# Altium project xDAC-v3.PrjPcb (part 7 of 7)
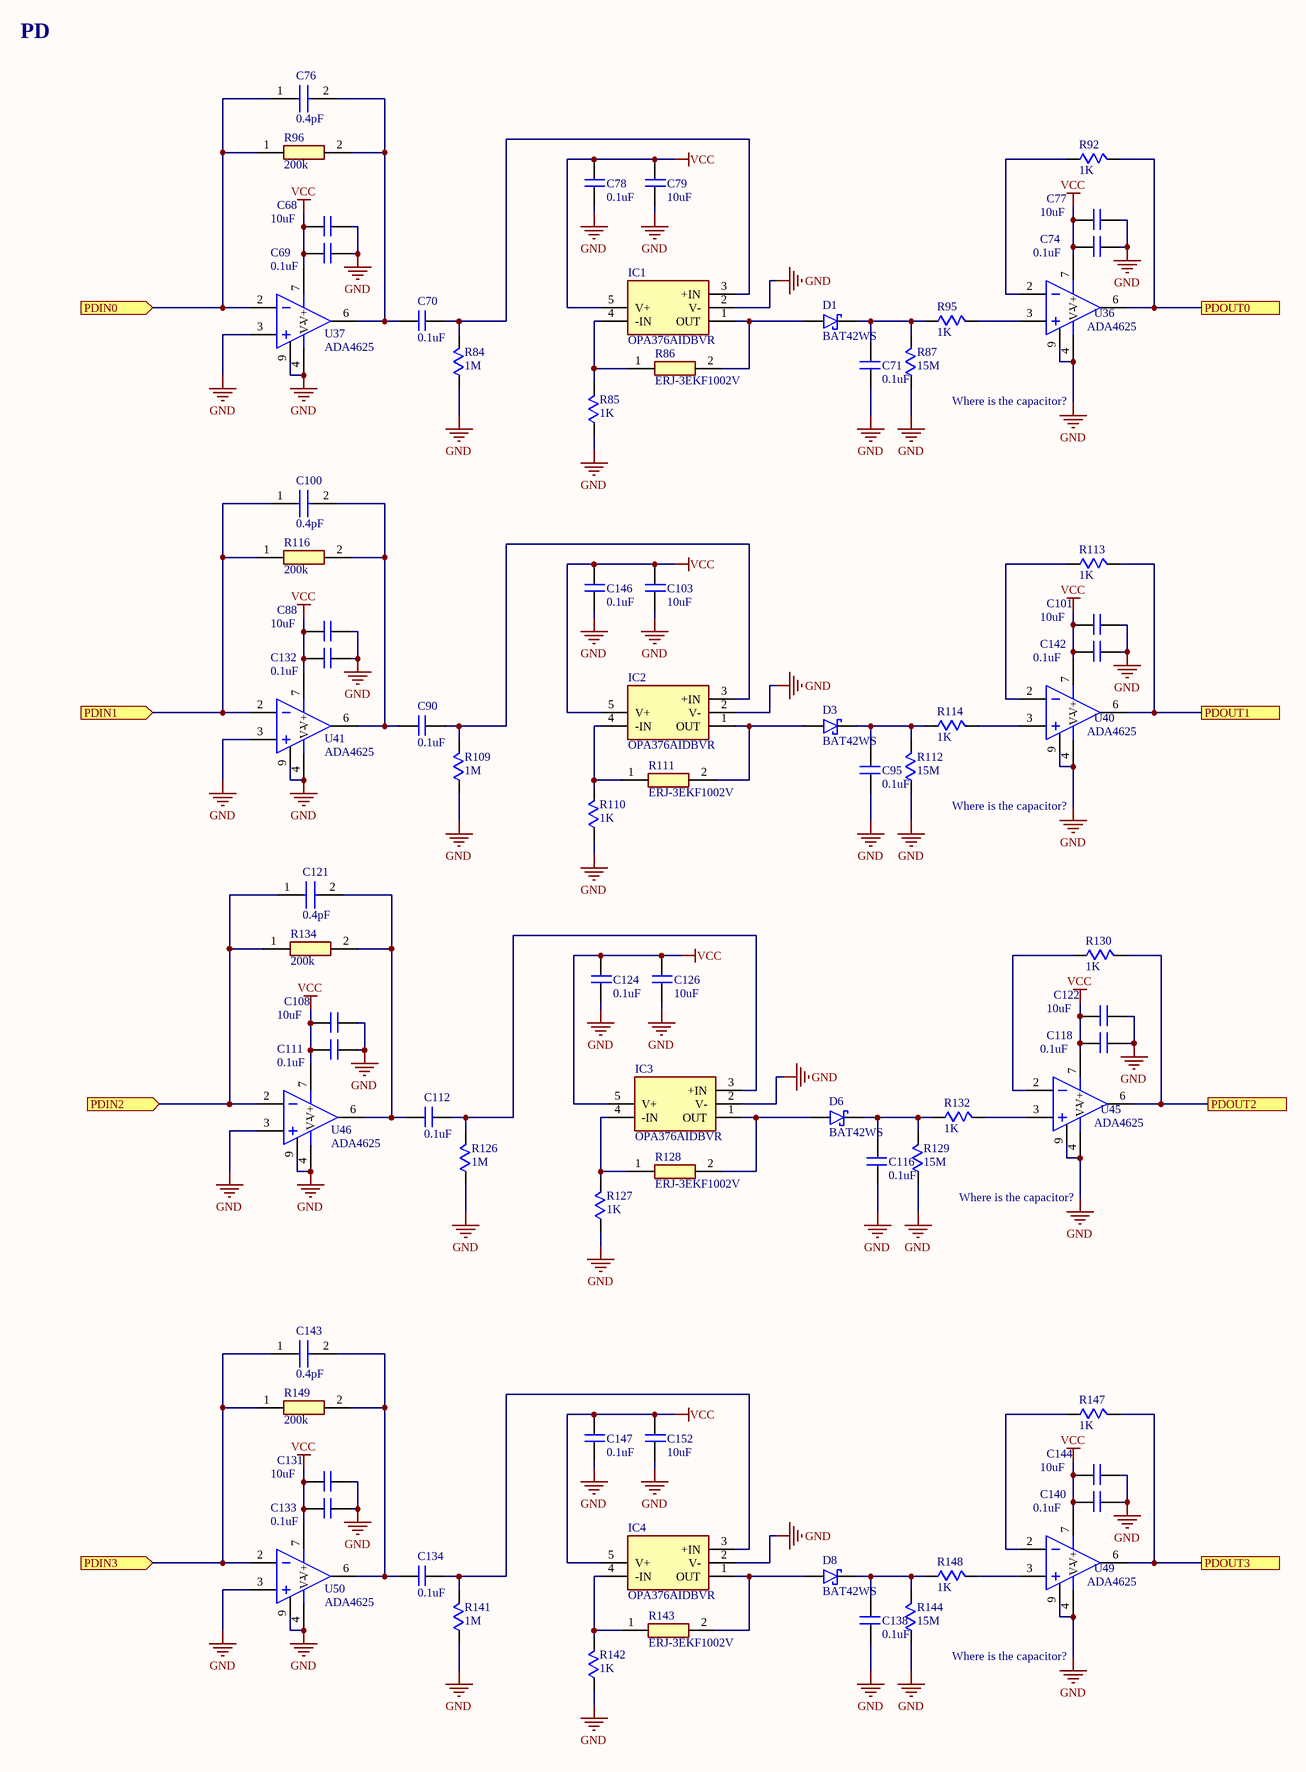
[diagram p23: PD.SchDoc]

## Nets that join several sheets
3V3: Fan & Power Out (Q8.2), iDAC1 (10 pins), iDAC2 (10 pins), Power (9 pins), TEC_CONTROLLER_1 (16 pins)
+8V: LIM+LEDS+POWER (U34.4), Power (8 pins)
+12V: Fan & Power Out (6 pins), PI_INTERFACE (J47.3 J47.5 J47.6), Power (38 pins)
-12V: Fan & Power Out (R121.1), Power (5 pins)
C1_V+: Power (C13.1 L6.2), vDAC1 (J20.25 J20.27), vDAC2 (J53.25 J53.27)
C1_V-: LIM+LEDS+POWER (U34.11), Power (C10.1 C47.2 L3.2 R53.2), vDAC1 (J20.43 J20.45), vDAC2 (J53.43 J53.45)
C2_V+: Power (C12.1 L5.2), vDAC1 (J20.26 J20.28), vDAC2 (J53.26 J53.28)
C2_V-: Fan & Power Out (R122.1), Power (C9.1 C73.2 L2.2 R93.2), vDAC1 (J20.44 J20.46), vDAC2 (J53.44 J53.46)
C3_V+: Power (C11.1 L4.2), vDAC1 (J20.83 J20.85), vDAC2 (J53.83 J53.85)
C3_V-: Power (C8.1 C67.2 L1.2 R88.2), vDAC1 (J20.91 J20.93), vDAC2 (J53.91 J53.93)
EDFA_POWER: PIO (J6.01 J6.02), Power (5 pins)
GND: ChipSelects+Faults (25 pins), Fan & Power Out (17 pins), iDAC1 (44 pins), iDAC2 (34 pins), LIM+LEDS+POWER (14 pins), PI_INTERFACE (26 pins), PIO (44 pins), Power (103 pins), RX_FlexiConnectors (62 pins), TEC_CONTROLLER_1 (22 pins), TEC_CONTROLLER_2 (12 pins), TEC_CONTROLLER_3 (12 pins), TX_FlexiConnectors (71 pins), vDAC1 (26 pins), vDAC2 (26 pins), ADC-DAC (55 pins), PIC closed loop (29 pins), PD (64 pins)
VCC: ChipSelects+Faults (29 pins), Fan & Power Out (20 pins), iDAC1 (24 pins), iDAC2 (24 pins), LIM+LEDS+POWER (10 pins), PI_INTERFACE (13 pins), PIO (30 pins), Power (7 pins), TEC_CONTROLLER_1 (5 pins), TEC_CONTROLLER_2 (5 pins), TEC_CONTROLLER_3 (5 pins), vDAC1 (18 pins), vDAC2 (10 pins), ADC-DAC (21 pins), PIC closed loop (32 pins), PD (36 pins)
VCC-TEC: Power (7 pins), TEC_CONTROLLER_1 (9 pins), TEC_CONTROLLER_2 (9 pins), TEC_CONTROLLER_3 (9 pins)
+5V-STANDBY: PI_INTERFACE (J1.3), Power (J22.9)
A_CLK: iDAC1 (J30.01), iDAC2 (J45.01), PI_INTERFACE (U64.4), vDAC1 (J20.01 R210.1), vDAC2 (J53.01)
A_SDI: iDAC1 (J30.03), iDAC2 (J45.03), PI_INTERFACE (U64.12), vDAC1 (J20.03 R208.1), vDAC2 (J53.03)
A_SDO: iDAC1 (J30.05), iDAC2 (J45.05), PI_INTERFACE (U64.9), vDAC1 (J20.05 R205.1), vDAC2 (J53.05)
B_CLK: iDAC1 (J30.02), iDAC2 (J45.02), PI_INTERFACE (U64.2), vDAC1 (J20.02 R211.1), vDAC2 (J53.02)
B_SDI: iDAC1 (J30.04), iDAC2 (J45.04), PI_INTERFACE (U64.10), vDAC1 (J20.04 R209.1), vDAC2 (J53.04)
B_SDO: iDAC1 (J30.06), iDAC2 (J45.06), PI_INTERFACE (U64.5), vDAC1 (J20.06 R206.1), vDAC2 (J53.06)
C_CLK: ChipSelects+Faults (5 pins), LIM+LEDS+POWER (R58.2), PI_INTERFACE (R2.1 R6.2 U64.1 U64.3), PIO (U1.8 U2.8 U27.8 U55.8)
C_SDI: ChipSelects+Faults (U25.9), LIM+LEDS+POWER (R61.2), PI_INTERFACE (5 pins), PIO (U1.9 U2.9 U27.9 U55.9)
C_SDO: LIM+LEDS+POWER (R60.1), PI_INTERFACE (R3.1 R4.2 U64.6 U64.8), PIO (U1.10 U2.10 U27.10 U55.10)
CS_PIO: ChipSelects+Faults (U65.13), PIO (U1.7)
CS_PIO2: ChipSelects+Faults (U65.11), PIO (U55.7)
CS_PIO3: ChipSelects+Faults (U65.10), PIO (U2.7)
CS_PIO4: PI_INTERFACE (R102.1 R103.2), PIO (U27.7)
EDFA1_PowerA: Fan & Power Out (J57.1 Q10.6), PIO (J14.1 J14.2 J14.29 J14.30)
EDFA3_PowerB: Fan & Power Out (J56.1 Q10.4), PIO (J12.1 J12.2 J12.29 J12.30)
EnEDFA1_PowerOut: Fan & Power Out (R195.1), PIO (U69.12)
FANALERT: ChipSelects+Faults (U25.7), Fan & Power Out (R29.1 U5.14)
FANFAIL: ChipSelects+Faults (U25.4), Fan & Power Out (R20.1 U5.5)
FANTHROTTLE: ChipSelects+Faults (U25.5), Fan & Power Out (R19.1 U5.6)
FP_LED: Fan & Power Out (J43.1), PI_INTERFACE (J2.15)
GPB4#: Fan & Power Out (R119.1), PIO (U69.8)
GPB5#: Fan & Power Out (R198.1), PIO (U69.10)
GPIO25: Fan & Power Out (Q14.3 R250.2), PI_INTERFACE (J2.22)
iDAC1_C1_CS: ChipSelects+Faults (U35.9), iDAC1 (J30.09)
iDAC1_C1_FAULT: ChipSelects+Faults (U39.6), iDAC1 (J30.23)
iDAC1_C1_OUT1: iDAC1 (J30.11), TX_FlexiConnectors (J10.60)
iDAC1_C1_OUT2: iDAC1 (J30.13), TX_FlexiConnectors (J10.58)
iDAC1_C1_OUT3: iDAC1 (J30.15), TX_FlexiConnectors (J10.57)
iDAC1_C1_OUT4: iDAC1 (J30.17), TX_FlexiConnectors (J10.55)
iDAC1_C1_OUT5: iDAC1 (J30.19), TX_FlexiConnectors (J10.54)
iDAC1_C2_CS: ChipSelects+Faults (U35.7), iDAC1 (J30.31)
iDAC1_C2_FAULT: ChipSelects+Faults (U39.7), iDAC1 (J30.45)
iDAC1_C2_OUT1: iDAC1 (J30.33), TX_FlexiConnectors (J10.53)
iDAC1_C2_OUT2: iDAC1 (J30.35), TX_FlexiConnectors (J10.52)
iDAC1_C2_OUT3: iDAC1 (J30.37), TX_FlexiConnectors (J10.51)
iDAC1_C2_OUT4: iDAC1 (J30.39), TX_FlexiConnectors (J10.50)
iDAC1_C2_OUT5: iDAC1 (J30.41), TX_FlexiConnectors (J15.27)
iDAC1_C3_CS: ChipSelects+Faults (U43.15), iDAC1 (J30.53)
iDAC1_C3_FAULT: ChipSelects+Faults (U47.15), iDAC1 (J30.67)
iDAC1_C3_OUT1: iDAC1 (J30.55), TX_FlexiConnectors (J15.25)
iDAC1_C3_OUT2: iDAC1 (J30.57), TX_FlexiConnectors (J15.23)
iDAC1_C3_OUT3: iDAC1 (J30.59), TX_FlexiConnectors (J15.21)
iDAC1_C3_OUT4: iDAC1 (J30.61), TX_FlexiConnectors (J15.19)
iDAC1_C3_OUT5: iDAC1 (J30.63), TX_FlexiConnectors (J15.17)
iDAC1_C4_CS: ChipSelects+Faults (U43.14), iDAC1 (J30.75)
iDAC1_C4_FAULT: ChipSelects+Faults (U47.1), iDAC1 (J30.89)
iDAC1_C4_OUT1: iDAC1 (J30.77), TX_FlexiConnectors (J15.15)
iDAC1_C4_OUT2: iDAC1 (J30.79), TX_FlexiConnectors (J15.13)
iDAC1_C4_OUT3: iDAC1 (J30.81), TX_FlexiConnectors (J15.11)
iDAC1_C4_OUT4: iDAC1 (J30.83), TX_FlexiConnectors (J15.9)
iDAC1_C4_OUT5: iDAC1 (J30.85), TX_FlexiConnectors (J15.7)
iDAC1_C5_CS: ChipSelects+Faults (U43.13), iDAC1 (J30.97)
iDAC1_C5_FAULT: ChipSelects+Faults (U47.2), iDAC1 (J30.111)
iDAC1_C5_OUT1: iDAC1 (J30.99), TX_FlexiConnectors (J15.5)
iDAC1_C5_OUT2: iDAC1 (J30.101), TX_FlexiConnectors (J10.3)
iDAC1_C5_OUT3: iDAC1 (J30.103), TX_FlexiConnectors (J10.5)
iDAC1_C5_OUT4: iDAC1 (J30.105), TX_FlexiConnectors (J10.6)
iDAC1_C5_OUT5: iDAC1 (J30.107), TX_FlexiConnectors (J10.8)
iDAC1_C6_CS: ChipSelects+Faults (U43.12), iDAC1 (J30.10)
iDAC1_C6_FAULT: ChipSelects+Faults (U47.3), iDAC1 (J30.24)
iDAC1_C6_OUT1: iDAC1 (J30.12), TX_FlexiConnectors (J10.9)
iDAC1_C6_OUT2: iDAC1 (J30.14), TX_FlexiConnectors (J10.13)
iDAC1_C6_OUT3: iDAC1 (J30.16), TX_FlexiConnectors (J10.19)
iDAC1_C6_OUT4: iDAC1 (J30.18), TX_FlexiConnectors (J10.25)
iDAC1_C6_OUT5: iDAC1 (J30.20), TX_FlexiConnectors (J5.31)
iDAC1_C7_CS: ChipSelects+Faults (U43.11), iDAC1 (J30.32)
iDAC1_C7_FAULT: ChipSelects+Faults (U47.4), iDAC1 (J30.46)
iDAC1_C8_CS: ChipSelects+Faults (U43.10), iDAC1 (J30.54)
iDAC1_C8_FAULT: ChipSelects+Faults (U47.5), iDAC1 (J30.68)
iDAC1_C9_CS: ChipSelects+Faults (U43.9), iDAC1 (J30.76)
iDAC1_C9_FAULT: ChipSelects+Faults (U47.6), iDAC1 (J30.90)
iDAC1_C10_CS: ChipSelects+Faults (U43.7), iDAC1 (J30.98)
iDAC1_C10_FAULT: ChipSelects+Faults (U47.7), iDAC1 (J30.112)
iDAC1_id0: ChipSelects+Faults (U59.2), iDAC1 (J30.117 R105.2 R106.1)
iDAC2_C1_CS: ChipSelects+Faults (U51.15), iDAC2 (J45.09)
iDAC2_C1_FAULT: ChipSelects+Faults (U53.15), iDAC2 (J45.23)
iDAC2_C1_OUT1: iDAC2 (J45.11), RX_FlexiConnectors (J58.60)
iDAC2_C1_OUT2: iDAC2 (J45.13), RX_FlexiConnectors (J58.59)
iDAC2_C1_OUT3: iDAC2 (J45.15), RX_FlexiConnectors (J58.57)
iDAC2_C1_OUT4: iDAC2 (J45.17), RX_FlexiConnectors (J58.56)
iDAC2_C1_OUT5: iDAC2 (J45.19), RX_FlexiConnectors (J58.54)
iDAC2_C2_CS: ChipSelects+Faults (U51.14), iDAC2 (J45.31)
iDAC2_C2_FAULT: ChipSelects+Faults (U53.1), iDAC2 (J45.45)
iDAC2_C2_OUT1: iDAC2 (J45.33), RX_FlexiConnectors (J58.53)
iDAC2_C2_OUT2: iDAC2 (J45.35), RX_FlexiConnectors (J58.51)
iDAC2_C2_OUT3: iDAC2 (J45.37), RX_FlexiConnectors (J58.50)
iDAC2_C2_OUT4: iDAC2 (J45.39), RX_FlexiConnectors (J58.48)
iDAC2_C2_OUT5: iDAC2 (J45.41), RX_FlexiConnectors (J58.47)
iDAC2_C3_CS: ChipSelects+Faults (U51.13), iDAC2 (J45.53)
iDAC2_C3_FAULT: ChipSelects+Faults (U53.2), iDAC2 (J45.67)
iDAC2_C3_OUT1: iDAC2 (J45.55), RX_FlexiConnectors (J58.45)
iDAC2_C3_OUT2: iDAC2 (J45.57), RX_FlexiConnectors (J58.44)
iDAC2_C3_OUT3: iDAC2 (J45.59), RX_FlexiConnectors (J58.42)
iDAC2_C3_OUT4: iDAC2 (J45.61), RX_FlexiConnectors (J58.41)
iDAC2_C3_OUT5: iDAC2 (J45.63), RX_FlexiConnectors (J58.39)
iDAC2_C4_CS: ChipSelects+Faults (U51.12), iDAC2 (J45.75)
iDAC2_C4_FAULT: ChipSelects+Faults (U53.3), iDAC2 (J45.89)
iDAC2_C4_OUT1: iDAC2 (J45.77), RX_FlexiConnectors (J58.38)
iDAC2_C4_OUT2: iDAC2 (J45.79), RX_FlexiConnectors (J58.36)
iDAC2_C4_OUT3: iDAC2 (J45.81), RX_FlexiConnectors (J58.35)
iDAC2_C4_OUT4: iDAC2 (J45.83), RX_FlexiConnectors (J58.33)
iDAC2_C4_OUT5: iDAC2 (J45.85), RX_FlexiConnectors (J58.32)
iDAC2_C5_CS: ChipSelects+Faults (U51.11), iDAC2 (J45.97)
iDAC2_C5_FAULT: ChipSelects+Faults (U53.4), iDAC2 (J45.111)
iDAC2_C5_OUT1: iDAC2 (J45.99), RX_FlexiConnectors (J58.30)
iDAC2_C6_CS: ChipSelects+Faults (U51.10), iDAC2 (J45.10)
iDAC2_C6_FAULT: ChipSelects+Faults (U53.5), iDAC2 (J45.24)
iDAC2_C6_OUT1: iDAC2 (J45.12), RX_FlexiConnectors (J61.60)
iDAC2_C6_OUT2: iDAC2 (J45.14), RX_FlexiConnectors (J61.59)
iDAC2_C6_OUT3: iDAC2 (J45.16), RX_FlexiConnectors (J61.57)
iDAC2_C6_OUT4: iDAC2 (J45.18), RX_FlexiConnectors (J61.56)
iDAC2_C6_OUT5: iDAC2 (J45.20), RX_FlexiConnectors (J61.54)
iDAC2_C7_CS: ChipSelects+Faults (U51.9), iDAC2 (J45.32)
iDAC2_C7_FAULT: ChipSelects+Faults (U53.6), iDAC2 (J45.46)
iDAC2_C7_OUT1: iDAC2 (J45.34), RX_FlexiConnectors (J61.53)
iDAC2_C7_OUT2: iDAC2 (J45.36), RX_FlexiConnectors (J61.51)
iDAC2_C7_OUT3: iDAC2 (J45.38), RX_FlexiConnectors (J61.50)
iDAC2_C7_OUT4: iDAC2 (J45.40), RX_FlexiConnectors (J61.48)
iDAC2_C7_OUT5: iDAC2 (J45.42), RX_FlexiConnectors (J61.47)
iDAC2_C8_CS: ChipSelects+Faults (U51.7), iDAC2 (J45.54)
iDAC2_C8_FAULT: ChipSelects+Faults (U53.7), iDAC2 (J45.68)
iDAC2_C8_OUT1: iDAC2 (J45.56), RX_FlexiConnectors (J61.45)
iDAC2_C8_OUT2: iDAC2 (J45.58), RX_FlexiConnectors (J61.44)
iDAC2_C8_OUT3: iDAC2 (J45.60), RX_FlexiConnectors (J61.42)
iDAC2_C8_OUT4: iDAC2 (J45.62), RX_FlexiConnectors (J61.41)
iDAC2_C8_OUT5: iDAC2 (J45.64), RX_FlexiConnectors (J61.39)
iDAC2_C9_CS: ChipSelects+Faults (U65.15), iDAC2 (J45.76)
iDAC2_C9_FAULT: ChipSelects+Faults (U59.15), iDAC2 (J45.90)
iDAC2_C9_OUT1: iDAC2 (J45.78), RX_FlexiConnectors (J61.38)
iDAC2_C9_OUT2: iDAC2 (J45.80), RX_FlexiConnectors (J61.36)
iDAC2_C9_OUT3: iDAC2 (J45.82), RX_FlexiConnectors (J61.35)
iDAC2_C9_OUT4: iDAC2 (J45.84), RX_FlexiConnectors (J61.33)
iDAC2_C9_OUT5: iDAC2 (J45.86), RX_FlexiConnectors (J61.32)
iDAC2_C10_CS: ChipSelects+Faults (U65.14), iDAC2 (J45.98)
iDAC2_C10_FAULT: ChipSelects+Faults (U59.1), iDAC2 (J45.112)
iDAC2_C10_OUT1: iDAC2 (J45.100), RX_FlexiConnectors (J61.30)
iDAC2_id0: ChipSelects+Faults (U59.3), iDAC2 (J45.117 R139.1 R140.2)
IDAC_OUT2: TEC_CONTROLLER_1 (U63.7), TEC_CONTROLLER_2 (U70.3)
IDAC_OUT3: TEC_CONTROLLER_1 (U63.8), TEC_CONTROLLER_3 (U72.3)
INTA: PI_INTERFACE (J2.16), PIO (U1.16 U2.16 U27.16 U55.16)
INTB: PI_INTERFACE (J2.18), PIO (U1.15 U2.15 U27.15 U55.15)
ITECB: TEC_CONTROLLER_1 (U58.2), TEC_CONTROLLER_2 (TP1.1 U74.13)
ITECC: TEC_CONTROLLER_1 (U58.4), TEC_CONTROLLER_3 (TP2.1 U73.13)
LDAC1: PI_INTERFACE (J2.7), TEC_CONTROLLER_1 (U63.4)
LDAC2: PI_INTERFACE (J2.11), TEC_CONTROLLER_1 (U30.4)
LED1: LIM+LEDS+POWER (U42.1), PIO (U55.1)
LED2: LIM+LEDS+POWER (U42.3), PIO (U55.2)
LED3: LIM+LEDS+POWER (U42.5), PIO (U55.3)
LED4: LIM+LEDS+POWER (U42.9), PIO (U55.4)
MUTE: LIM+LEDS+POWER (R59.1), PIO (R32.2 U2.4)
Offset: ADC-DAC (U29.7), PIC closed loop (U6.5)
Offset1: ADC-DAC (U29.11), PIC closed loop (U7.5)
PD_EN: Fan & Power Out (R124.1), PIO (U55.23)
PDIN0: ADC-DAC (J21.1), PD (C76.1 R96.1 U37.2)
PDIN1: ADC-DAC (J24.1), PD (C100.1 R116.1 U41.2)
PDIN2: ADC-DAC (J31.1), PD (C121.1 R134.1 U46.2)
PDIN3: ADC-DAC (J46.1), PD (C143.1 R149.1 U50.2)
PDOUT0: ADC-DAC (R201.2), PD (R92.2 U36.6)
PDOUT1: ADC-DAC (R200.2), PD (R113.2 U40.6)
PDOUT2: ADC-DAC (R196.2), PD (R130.2 U45.6)
PDOUT3: ADC-DAC (R172.2), PD (R147.2 U49.6)
PG: ChipSelects+Faults (U25.3), Power (J22.8)
PI_CS0: ChipSelects+Faults (U31.1 U43.4 U51.4 U65.4), PI_INTERFACE (J2.24)
PI_CS1: ChipSelects+Faults (U31.3 U35.4 U65.5), PI_INTERFACE (J2.26)
PIaddr0: ChipSelects+Faults (U35.1 U43.1 U51.1 U65.1), PI_INTERFACE (J2.31)
PIaddr1: ChipSelects+Faults (U35.2 U43.2 U51.2 U65.2), PI_INTERFACE (J2.33)
PIaddr2: ChipSelects+Faults (U35.3 U43.3 U51.3 U65.3), PI_INTERFACE (J2.35)
PIaddr3: ChipSelects+Faults (U31.5 U35.6 U43.6), PI_INTERFACE (J2.37)
PS_ON: PI_INTERFACE (J2.28), Power (J22.16 R7.2)
Q-falling edge0: PIO (U27.27), PIC closed loop (U21.5)
Q-falling edge1: PIO (U27.22), PIC closed loop (U23.5)
Q-rising edge0: PIO (U27.2), PIC closed loop (U22.5)
Q-rising edge1: PIO (U27.19), PIC closed loop (U24.5)
reset-falling edge0: PIO (U27.26), PIC closed loop (U21.6)
reset-falling edge1: PIO (U27.23), PIC closed loop (U23.6)
reset-rising edge0: PIO (U27.1), PIC closed loop (U22.6)
reset-rising edge1: PIO (U27.20), PIC closed loop (U24.6)
RF_CS: ChipSelects+Faults (U65.12), LIM+LEDS+POWER (R62.2)
ROCKER: Fan & Power Out (Q13.3 R248.2), PI_INTERFACE (J2.13)
RX1: PI_INTERFACE (U3.15), PIO (J14.7)
RX2: PI_INTERFACE (U3.14), PIO (J6.05)
RX3: PI_INTERFACE (U3.13), PIO (J12.7)
RX_In1: PI_INTERFACE (U18.6), PIO (J14.8)
RX_In2: PI_INTERFACE (U18.5), PIO (J6.06)
RX_In3: PI_INTERFACE (U18.4), PIO (J12.8)
SCL: Fan & Power Out (U5.16), PI_INTERFACE (J2.5), TEC_CONTROLLER_1 (U30.2 U58.13 U63.2), ADC-DAC (7 pins)
SDA: Fan & Power Out (U5.15), PI_INTERFACE (J2.3), TEC_CONTROLLER_1 (U30.3 U58.14 U63.3), ADC-DAC (7 pins)
SEL0: PI_INTERFACE (U3.1 U18.14), PIO (R166.2 U55.25)
SEL1: PI_INTERFACE (U3.2 U18.2), PIO (R169.2 U55.26)
Set-falling edge0: PIO (U27.25), PIC closed loop (U21.7)
Set-falling edge1: PIO (U27.24), PIC closed loop (U23.7)
Set-rising edge0: PIO (U27.28), PIC closed loop (U22.7)
Set-rising edge1: PIO (U27.21), PIC closed loop (U24.7)
SHUTDOWN: ChipSelects+Faults (U25.6), Fan & Power Out (R28.1 U5.7)
SYS_RESET: iDAC1 (J30.07 J30.08), iDAC2 (J45.07 J45.08), PI_INTERFACE (U4.2), PIO (U1.14 U2.14 U27.14 U55.14), vDAC1 (J20.07 J20.08 R203.1 R204.1), vDAC2 (J53.07 J53.08)
TEC_SHUTDOWN1: PIO (U69.2), TEC_CONTROLLER_1 (U75.17)
TEC_SHUTDOWN2: PIO (U69.4), TEC_CONTROLLER_2 (U74.17)
TEC_SHUTDOWN3: PIO (U69.6), TEC_CONTROLLER_3 (U73.17)
THB1: TEC_CONTROLLER_1 (U58.16), TEC_CONTROLLER_2 (J68.1 R229.2 U70.5)
THC1: TEC_CONTROLLER_1 (U58.3), TEC_CONTROLLER_3 (J66.1 R237.2 U72.5)
vDAC1_C1_CS: ChipSelects+Faults (U35.15), vDAC1 (J20.09)
vDAC1_C1_FAULT: ChipSelects+Faults (U39.15), vDAC1 (J20.23)
vDAC1_C1_OUT1: TX_FlexiConnectors (J10.48), vDAC1 (J20.11)
vDAC1_C1_OUT2: TX_FlexiConnectors (J10.47), vDAC1 (J20.13)
vDAC1_C1_OUT3: TX_FlexiConnectors (J10.45), vDAC1 (J20.15)
vDAC1_C1_OUT4: TX_FlexiConnectors (J10.43), vDAC1 (J20.17)
vDAC1_C1_OUT5: TX_FlexiConnectors (J10.42), vDAC1 (J20.19)
vDAC1_C1_OUT6: TX_FlexiConnectors (J10.41), vDAC1 (J20.33)
vDAC1_C1_OUT7: TX_FlexiConnectors (J10.40), vDAC1 (J20.35)
vDAC1_C1_OUT8: TX_FlexiConnectors (J10.39), vDAC1 (J20.37)
vDAC1_C1_OUT9: TX_FlexiConnectors (J10.38), vDAC1 (J20.39)
vDAC1_C1_OUT10: TX_FlexiConnectors (J10.37), vDAC1 (J20.41)
vDAC1_C1_OUT11: TX_FlexiConnectors (J10.36), vDAC1 (J20.55)
vDAC1_C1_OUT12: TX_FlexiConnectors (J10.35), vDAC1 (J20.57)
vDAC1_C1_OUT13: TX_FlexiConnectors (J10.34), vDAC1 (J20.59)
vDAC1_C1_OUT14: TX_FlexiConnectors (J10.33), vDAC1 (J20.61)
vDAC1_C1_OUT15: TX_FlexiConnectors (J10.32), vDAC1 (J16.13 J20.63)
vDAC1_C1_OUT16: TX_FlexiConnectors (J5.34), vDAC1 (J16.15 J20.65)
vDAC1_C2_CS: ChipSelects+Faults (U35.14), vDAC1 (J20.10)
vDAC1_C2_FAULT: ChipSelects+Faults (U39.1), vDAC1 (J20.24)
vDAC1_C2_OUT1: TX_FlexiConnectors (J10.31), vDAC1 (J20.12)
vDAC1_C2_OUT2: TX_FlexiConnectors (J15.30), vDAC1 (J20.14)
vDAC1_C2_OUT3: TX_FlexiConnectors (J15.29), vDAC1 (J20.16)
vDAC1_C2_OUT4: TX_FlexiConnectors (J15.28), vDAC1 (J20.18)
vDAC1_C2_OUT5: TX_FlexiConnectors (J15.3), vDAC1 (J20.20)
vDAC1_C2_OUT6: TX_FlexiConnectors (J10.2), vDAC1 (J20.34)
vDAC1_C2_OUT7: TX_FlexiConnectors (J10.10), vDAC1 (J20.36)
vDAC1_C2_OUT8: TX_FlexiConnectors (J10.11), vDAC1 (J20.38)
vDAC1_C2_OUT9: TX_FlexiConnectors (J10.12), vDAC1 (J20.40)
vDAC1_C2_OUT10: TX_FlexiConnectors (J10.15), vDAC1 (J20.42)
vDAC1_C2_OUT11: TX_FlexiConnectors (J10.16), vDAC1 (J20.56)
vDAC1_C2_OUT12: TX_FlexiConnectors (J10.17), vDAC1 (J20.58)
vDAC1_C2_OUT13: TX_FlexiConnectors (J10.18), vDAC1 (J20.60)
vDAC1_C2_OUT14: TX_FlexiConnectors (J10.21), vDAC1 (J20.62)
vDAC1_C2_OUT15: TX_FlexiConnectors (J10.22), vDAC1 (J20.64)
vDAC1_C2_OUT16: TX_FlexiConnectors (J10.23), vDAC1 (J20.66)
vDAC1_C3_CS: ChipSelects+Faults (U35.13), vDAC1 (J20.67)
vDAC1_C3_FAULT: ChipSelects+Faults (U39.2), vDAC1 (J20.81)
vDAC1_C3_OUT1: TX_FlexiConnectors (J10.24), vDAC1 (J20.69)
vDAC1_C3_OUT2: TX_FlexiConnectors (J10.27), vDAC1 (J20.71)
vDAC1_C3_OUT3: TX_FlexiConnectors (J10.28), vDAC1 (J20.73)
vDAC1_C3_OUT4: TX_FlexiConnectors (J10.29), vDAC1 (J20.75)
vDAC1_C3_OUT5: TX_FlexiConnectors (J10.30), vDAC1 (J20.77)
vDAC1_C3_OUT6: TX_FlexiConnectors (J5.32), vDAC1 (J20.70)
vDAC1_C3_OUT7: TX_FlexiConnectors (J10.46), vDAC1 (J20.72)
vDAC1_C3_OUT8: TX_FlexiConnectors (J10.44), vDAC1 (J20.74)
vDAC1_C3_OUT9: TX_FlexiConnectors (J15.43), vDAC1 (J20.76)
vDAC1_C3_OUT10: TX_FlexiConnectors (J15.41), vDAC1 (J20.78)
vDAC1_C3_OUT11: TX_FlexiConnectors (J15.40), vDAC1 (J20.80)
vDAC1_C3_OUT12: TX_FlexiConnectors (J15.38), vDAC1 (J20.82)
vDAC1_C3_OUT13: TX_FlexiConnectors (J15.37), vDAC1 (J20.84)
vDAC1_C3_OUT14: TX_FlexiConnectors (J15.35), vDAC1 (J20.86)
vDAC1_C3_OUT15: TX_FlexiConnectors (J15.34), vDAC1 (J20.88)
vDAC1_C3_OUT16: TX_FlexiConnectors (J15.32), vDAC1 (J20.90)
vDAC1_id0: ChipSelects+Faults (U59.4), vDAC1 (J20.97 R74.2 R75.1)
vDAC2_C1_CS: ChipSelects+Faults (U35.12), vDAC2 (J53.09)
vDAC2_C1_FAULT: ChipSelects+Faults (U39.3), vDAC2 (J53.23)
vDAC2_C1_OUT1: TX_FlexiConnectors (J5.29), vDAC2 (J53.11)
vDAC2_C1_OUT2: TX_FlexiConnectors (J5.26), vDAC2 (J53.13)
vDAC2_C1_OUT3: TX_FlexiConnectors (J5.23), vDAC2 (J53.15)
vDAC2_C1_OUT4: TX_FlexiConnectors (J5.20), vDAC2 (J53.17)
vDAC2_C1_OUT5: TX_FlexiConnectors (J5.17), vDAC2 (J53.19)
vDAC2_C1_OUT6: TX_FlexiConnectors (J5.13), vDAC2 (J53.33)
vDAC2_C1_OUT7: TX_FlexiConnectors (J5.10), vDAC2 (J53.35)
vDAC2_C1_OUT8: TX_FlexiConnectors (J5.7), vDAC2 (J53.37)
vDAC2_C1_OUT9: TX_FlexiConnectors (J5.4), vDAC2 (J53.39)
vDAC2_C1_OUT10: TX_FlexiConnectors (J15.59), vDAC2 (J53.41)
vDAC2_C1_OUT11: TX_FlexiConnectors (J15.56), vDAC2 (J53.55)
vDAC2_C1_OUT12: TX_FlexiConnectors (J15.53), vDAC2 (J53.57)
vDAC2_C1_OUT13: TX_FlexiConnectors (J15.50), vDAC2 (J53.59)
vDAC2_C1_OUT14: TX_FlexiConnectors (J15.47), vDAC2 (J53.61)
vDAC2_C2_CS: ChipSelects+Faults (U35.11), vDAC2 (J53.10)
vDAC2_C2_FAULT: ChipSelects+Faults (U39.4), vDAC2 (J53.24)
vDAC2_C2_OUT1: TX_FlexiConnectors (J5.28), vDAC2 (J53.12)
vDAC2_C2_OUT2: TX_FlexiConnectors (J5.25), vDAC2 (J53.14)
vDAC2_C2_OUT3: TX_FlexiConnectors (J5.22), vDAC2 (J53.16)
vDAC2_C2_OUT4: TX_FlexiConnectors (J5.19), vDAC2 (J53.18)
vDAC2_C2_OUT5: TX_FlexiConnectors (J5.14), vDAC2 (J53.20)
vDAC2_C2_OUT6: TX_FlexiConnectors (J5.11), vDAC2 (J53.34)
vDAC2_C2_OUT7: TX_FlexiConnectors (J5.8), vDAC2 (J53.36)
vDAC2_C2_OUT8: TX_FlexiConnectors (J5.5), vDAC2 (J53.38)
vDAC2_C2_OUT9: TX_FlexiConnectors (J5.2), vDAC2 (J53.40)
vDAC2_C2_OUT10: TX_FlexiConnectors (J15.58), vDAC2 (J53.42)
vDAC2_C2_OUT11: TX_FlexiConnectors (J15.55), vDAC2 (J53.56)
vDAC2_C2_OUT12: TX_FlexiConnectors (J15.52), vDAC2 (J53.58)
vDAC2_C2_OUT13: TX_FlexiConnectors (J15.49), vDAC2 (J53.60)
vDAC2_C2_OUT14: TX_FlexiConnectors (J15.44), vDAC2 (J53.62)
vDAC2_C3_CS: ChipSelects+Faults (U35.10), vDAC2 (J53.67)
vDAC2_C3_FAULT: ChipSelects+Faults (U39.5), vDAC2 (J53.81)
vDAC2_C3_OUT1: RX_FlexiConnectors (J58.27), vDAC2 (J53.69)
vDAC2_C3_OUT2: RX_FlexiConnectors (J58.26), vDAC2 (J53.71)
vDAC2_C3_OUT3: RX_FlexiConnectors (J58.24), vDAC2 (J53.73)
vDAC2_C3_OUT4: RX_FlexiConnectors (J58.23), vDAC2 (J53.75)
vDAC2_C3_OUT5: RX_FlexiConnectors (J58.21), vDAC2 (J53.77)
vDAC2_C3_OUT6: RX_FlexiConnectors (J58.20), vDAC2 (J53.70)
vDAC2_C3_OUT7: RX_FlexiConnectors (J58.18), vDAC2 (J53.72)
vDAC2_C3_OUT8: RX_FlexiConnectors (J58.17), vDAC2 (J53.74)
vDAC2_C3_OUT9: RX_FlexiConnectors (J61.27), vDAC2 (J53.76)
vDAC2_C3_OUT10: RX_FlexiConnectors (J61.26), vDAC2 (J53.78)
vDAC2_C3_OUT11: RX_FlexiConnectors (J61.24), vDAC2 (J53.80)
vDAC2_C3_OUT12: RX_FlexiConnectors (J61.23), vDAC2 (J53.82)
vDAC2_C3_OUT13: RX_FlexiConnectors (J61.21), vDAC2 (J53.84)
vDAC2_C3_OUT14: RX_FlexiConnectors (J61.20), vDAC2 (J53.86)
vDAC2_C3_OUT15: RX_FlexiConnectors (J61.18), vDAC2 (J53.88)
vDAC2_C3_OUT16: RX_FlexiConnectors (J61.17), vDAC2 (J53.90)
vDAC2_id0: ChipSelects+Faults (U59.5), vDAC2 (J53.97 R170.1 R171.2)
Vout: ADC-DAC (R183.2), PIC closed loop (C20.1 C24.1 U6.6)
Vout1: ADC-DAC (R168.2), PIC closed loop (C26.1 C29.1 U7.6)
VOUT4: LIM+LEDS+POWER (R83.1), TEC_CONTROLLER_1 (U30.9)
VOUT5: LIM+LEDS+POWER (R82.1), TEC_CONTROLLER_1 (U30.8)
VOUT6: LIM+LEDS+POWER (R100.1), TEC_CONTROLLER_1 (U30.7)
VOUT7: LIM+LEDS+POWER (R101.1), TEC_CONTROLLER_1 (U30.6)
Vpic: ADC-DAC (J8.1), PIC closed loop (U9.3)
Vpic1: ADC-DAC (J9.1), PIC closed loop (U10.3)
Vpic-ADC: ADC-DAC (R199.2), PIC closed loop (U6.2 U9.1 U9.4)
Vpic-ADC1: ADC-DAC (R167.2), PIC closed loop (U7.2 U10.1 U10.4)
Vtrim: ADC-DAC (U29.10), PIC closed loop (U6.3)
Vtrim1: ADC-DAC (U29.12), PIC closed loop (U7.3)